# EAGLE design currentBaseBoard_v4 (EAGLE 9.5.1)
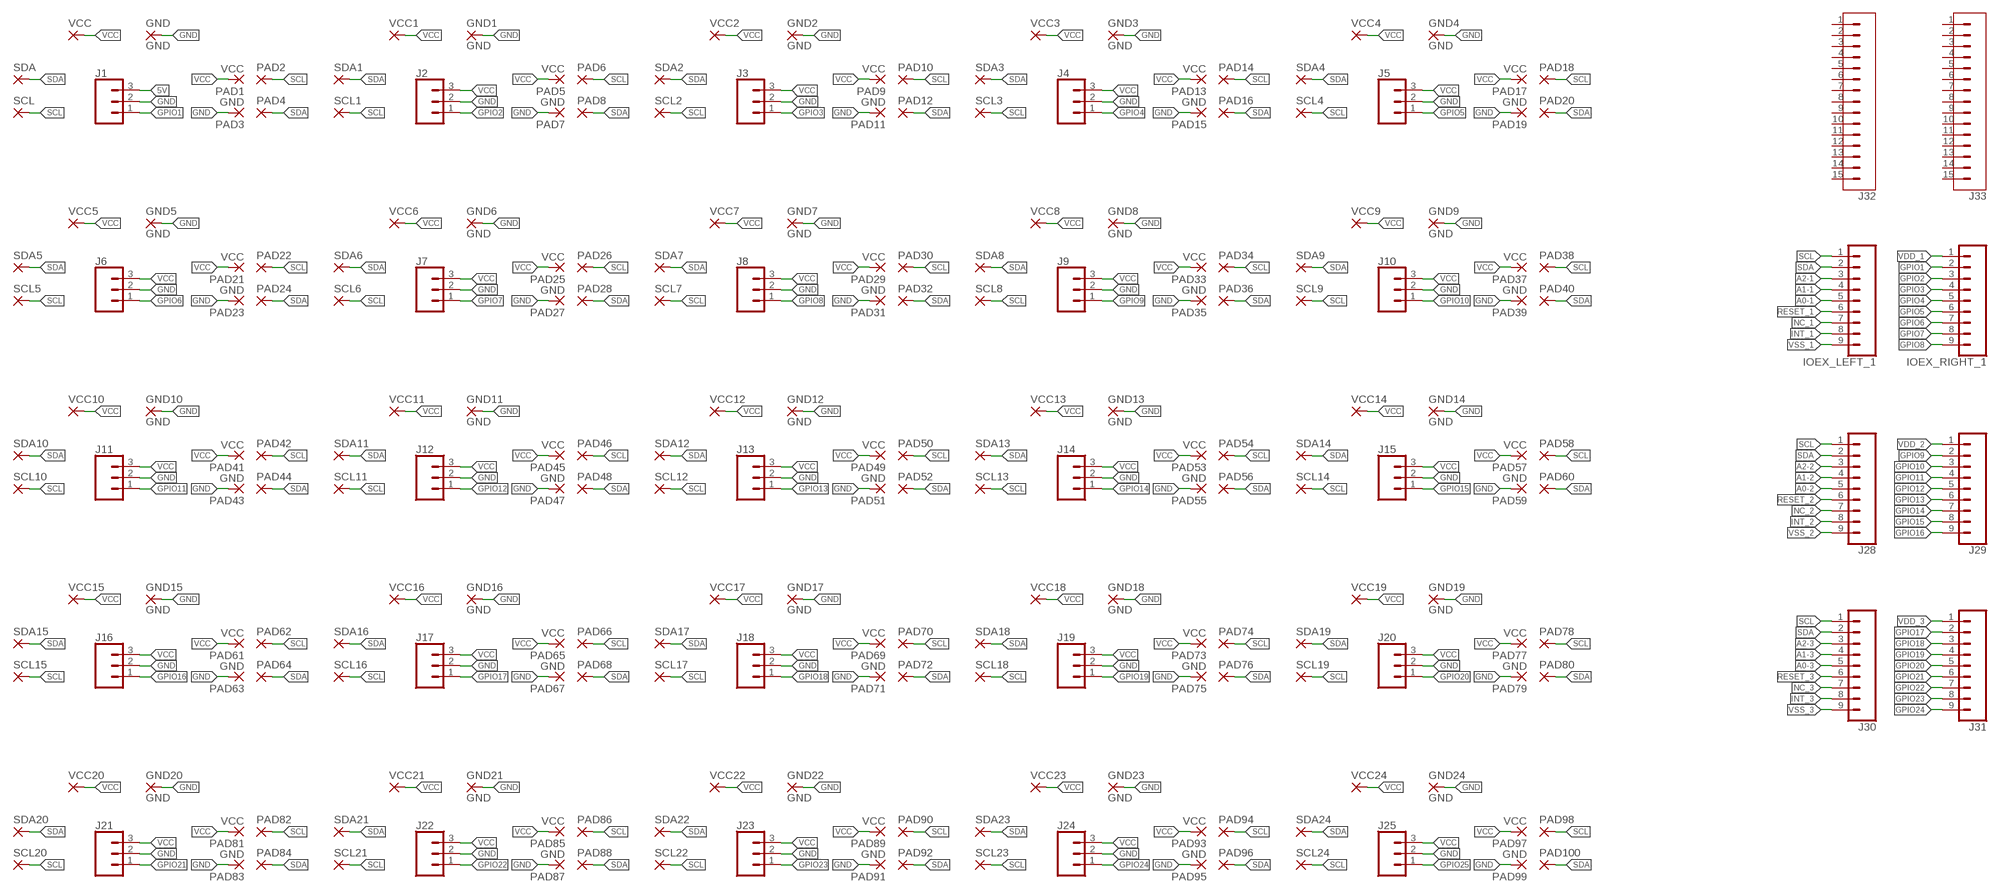
[diagram p0: schematic, sheet 1]

## Parts
GND  GND  2,15/1,0  [2,15/1,0]
GND1  GND  2,15/1,0  [2,15/1,0]
GND2  GND  2,15/1,0  [2,15/1,0]
GND3  GND  2,15/1,0  [2,15/1,0]
GND4  GND  2,15/1,0  [2,15/1,0]
GND5  GND  2,15/1,0  [2,15/1,0]
GND6  GND  2,15/1,0  [2,15/1,0]
GND7  GND  2,15/1,0  [2,15/1,0]
GND8  GND  2,15/1,0  [2,15/1,0]
GND9  GND  2,15/1,0  [2,15/1,0]
GND10  GND  2,15/1,0  [2,15/1,0]
GND11  GND  2,15/1,0  [2,15/1,0]
GND12  GND  2,15/1,0  [2,15/1,0]
GND13  GND  2,15/1,0  [2,15/1,0]
GND14  GND  2,15/1,0  [2,15/1,0]
GND15  GND  2,15/1,0  [2,15/1,0]
GND16  GND  2,15/1,0  [2,15/1,0]
GND17  GND  2,15/1,0  [2,15/1,0]
GND18  GND  2,15/1,0  [2,15/1,0]
GND19  GND  2,15/1,0  [2,15/1,0]
GND20  GND  2,15/1,0  [2,15/1,0]
GND21  GND  2,15/1,0  [2,15/1,0]
GND22  GND  2,15/1,0  [2,15/1,0]
GND23  GND  2,15/1,0  [2,15/1,0]
GND24  GND  2,15/1,0  [2,15/1,0]
IOEX_LEFT_1  CONN_09  [1X09]
IOEX_RIGHT_1  CONN_09  [1X09]
J1  CONN_03  [1X03]
J2  CONN_03  [1X03]
J3  CONN_03  [1X03]
J4  CONN_03  [1X03]
J5  CONN_03  [1X03]
J6  CONN_03  [1X03]
J7  CONN_03  [1X03]
J8  CONN_03  [1X03]
J9  CONN_03  [1X03]
J10  CONN_03  [1X03]
J11  CONN_03  [1X03]
J12  CONN_03  [1X03]
J13  CONN_03  [1X03]
J14  CONN_03  [1X03]
J15  CONN_03  [1X03]
J16  CONN_03  [1X03]
J17  CONN_03  [1X03]
J18  CONN_03  [1X03]
J19  CONN_03  [1X03]
J20  CONN_03  [1X03]
J21  CONN_03  [1X03]
J22  CONN_03  [1X03]
J23  CONN_03  [1X03]
J24  CONN_03  [1X03]
J25  CONN_03  [1X03]
J28  CONN_09  [1X09]
J29  CONN_09  [1X09]
J30  CONN_09  [1X09]
J31  CONN_09  [1X09]
J32  CONN_06SMD_MALE  [1X15_SMD_MALE]
J33  CONN_06SMD_MALE  [1X15_SMD_MALE]
PAD1  VCC  2,15/1,0  [2,15/1,0]
PAD2  2,15/1,0  [2,15/1,0]
PAD3  GND  2,15/1,0  [2,15/1,0]
PAD4  2,15/1,0  [2,15/1,0]
PAD5  VCC  2,15/1,0  [2,15/1,0]
PAD6  2,15/1,0  [2,15/1,0]
PAD7  GND  2,15/1,0  [2,15/1,0]
PAD8  2,15/1,0  [2,15/1,0]
PAD9  VCC  2,15/1,0  [2,15/1,0]
PAD10  2,15/1,0  [2,15/1,0]
PAD11  GND  2,15/1,0  [2,15/1,0]
PAD12  2,15/1,0  [2,15/1,0]
PAD13  VCC  2,15/1,0  [2,15/1,0]
PAD14  2,15/1,0  [2,15/1,0]
PAD15  GND  2,15/1,0  [2,15/1,0]
PAD16  2,15/1,0  [2,15/1,0]
PAD17  VCC  2,15/1,0  [2,15/1,0]
PAD18  2,15/1,0  [2,15/1,0]
PAD19  GND  2,15/1,0  [2,15/1,0]
PAD20  2,15/1,0  [2,15/1,0]
PAD21  VCC  2,15/1,0  [2,15/1,0]
PAD22  2,15/1,0  [2,15/1,0]
PAD23  GND  2,15/1,0  [2,15/1,0]
PAD24  2,15/1,0  [2,15/1,0]
PAD25  VCC  2,15/1,0  [2,15/1,0]
PAD26  2,15/1,0  [2,15/1,0]
PAD27  GND  2,15/1,0  [2,15/1,0]
PAD28  2,15/1,0  [2,15/1,0]
PAD29  VCC  2,15/1,0  [2,15/1,0]
PAD30  2,15/1,0  [2,15/1,0]
PAD31  GND  2,15/1,0  [2,15/1,0]
PAD32  2,15/1,0  [2,15/1,0]
PAD33  VCC  2,15/1,0  [2,15/1,0]
PAD34  2,15/1,0  [2,15/1,0]
PAD35  GND  2,15/1,0  [2,15/1,0]
PAD36  2,15/1,0  [2,15/1,0]
PAD37  VCC  2,15/1,0  [2,15/1,0]
PAD38  2,15/1,0  [2,15/1,0]
PAD39  GND  2,15/1,0  [2,15/1,0]
PAD40  2,15/1,0  [2,15/1,0]
PAD41  VCC  2,15/1,0  [2,15/1,0]
PAD42  2,15/1,0  [2,15/1,0]
PAD43  GND  2,15/1,0  [2,15/1,0]
PAD44  2,15/1,0  [2,15/1,0]
PAD45  VCC  2,15/1,0  [2,15/1,0]
PAD46  2,15/1,0  [2,15/1,0]
PAD47  GND  2,15/1,0  [2,15/1,0]
PAD48  2,15/1,0  [2,15/1,0]
PAD49  VCC  2,15/1,0  [2,15/1,0]
PAD50  2,15/1,0  [2,15/1,0]
PAD51  GND  2,15/1,0  [2,15/1,0]
PAD52  2,15/1,0  [2,15/1,0]
PAD53  VCC  2,15/1,0  [2,15/1,0]
PAD54  2,15/1,0  [2,15/1,0]
PAD55  GND  2,15/1,0  [2,15/1,0]
PAD56  2,15/1,0  [2,15/1,0]
PAD57  VCC  2,15/1,0  [2,15/1,0]
PAD58  2,15/1,0  [2,15/1,0]
PAD59  GND  2,15/1,0  [2,15/1,0]
PAD60  2,15/1,0  [2,15/1,0]
PAD61  VCC  2,15/1,0  [2,15/1,0]
PAD62  2,15/1,0  [2,15/1,0]
PAD63  GND  2,15/1,0  [2,15/1,0]
PAD64  2,15/1,0  [2,15/1,0]
PAD65  VCC  2,15/1,0  [2,15/1,0]
PAD66  2,15/1,0  [2,15/1,0]
PAD67  GND  2,15/1,0  [2,15/1,0]
PAD68  2,15/1,0  [2,15/1,0]
PAD69  VCC  2,15/1,0  [2,15/1,0]
PAD70  2,15/1,0  [2,15/1,0]
PAD71  GND  2,15/1,0  [2,15/1,0]
PAD72  2,15/1,0  [2,15/1,0]
PAD73  VCC  2,15/1,0  [2,15/1,0]
PAD74  2,15/1,0  [2,15/1,0]
PAD75  GND  2,15/1,0  [2,15/1,0]
PAD76  2,15/1,0  [2,15/1,0]
PAD77  VCC  2,15/1,0  [2,15/1,0]
PAD78  2,15/1,0  [2,15/1,0]
PAD79  GND  2,15/1,0  [2,15/1,0]
PAD80  2,15/1,0  [2,15/1,0]
PAD81  VCC  2,15/1,0  [2,15/1,0]
PAD82  2,15/1,0  [2,15/1,0]
PAD83  GND  2,15/1,0  [2,15/1,0]
PAD84  2,15/1,0  [2,15/1,0]
PAD85  VCC  2,15/1,0  [2,15/1,0]
PAD86  2,15/1,0  [2,15/1,0]
PAD87  GND  2,15/1,0  [2,15/1,0]
PAD88  2,15/1,0  [2,15/1,0]
PAD89  VCC  2,15/1,0  [2,15/1,0]
PAD90  2,15/1,0  [2,15/1,0]
PAD91  GND  2,15/1,0  [2,15/1,0]
PAD92  2,15/1,0  [2,15/1,0]
PAD93  VCC  2,15/1,0  [2,15/1,0]
PAD94  2,15/1,0  [2,15/1,0]
PAD95  GND  2,15/1,0  [2,15/1,0]
PAD96  2,15/1,0  [2,15/1,0]
PAD97  VCC  2,15/1,0  [2,15/1,0]
PAD98  2,15/1,0  [2,15/1,0]
PAD99  GND  2,15/1,0  [2,15/1,0]
PAD100  2,15/1,0  [2,15/1,0]
SCL  2,15/1,0  [2,15/1,0]
SCL1  2,15/1,0  [2,15/1,0]
SCL2  2,15/1,0  [2,15/1,0]
SCL3  2,15/1,0  [2,15/1,0]
SCL4  2,15/1,0  [2,15/1,0]
SCL5  2,15/1,0  [2,15/1,0]
SCL6  2,15/1,0  [2,15/1,0]
SCL7  2,15/1,0  [2,15/1,0]
SCL8  2,15/1,0  [2,15/1,0]
SCL9  2,15/1,0  [2,15/1,0]
SCL10  2,15/1,0  [2,15/1,0]
SCL11  2,15/1,0  [2,15/1,0]
SCL12  2,15/1,0  [2,15/1,0]
SCL13  2,15/1,0  [2,15/1,0]
SCL14  2,15/1,0  [2,15/1,0]
SCL15  2,15/1,0  [2,15/1,0]
SCL16  2,15/1,0  [2,15/1,0]
SCL17  2,15/1,0  [2,15/1,0]
SCL18  2,15/1,0  [2,15/1,0]
SCL19  2,15/1,0  [2,15/1,0]
SCL20  2,15/1,0  [2,15/1,0]
SCL21  2,15/1,0  [2,15/1,0]
SCL22  2,15/1,0  [2,15/1,0]
SCL23  2,15/1,0  [2,15/1,0]
SCL24  2,15/1,0  [2,15/1,0]
SDA  2,15/1,0  [2,15/1,0]
SDA1  2,15/1,0  [2,15/1,0]
SDA2  2,15/1,0  [2,15/1,0]
SDA3  2,15/1,0  [2,15/1,0]
SDA4  2,15/1,0  [2,15/1,0]
SDA5  2,15/1,0  [2,15/1,0]
SDA6  2,15/1,0  [2,15/1,0]
SDA7  2,15/1,0  [2,15/1,0]
SDA8  2,15/1,0  [2,15/1,0]
SDA9  2,15/1,0  [2,15/1,0]
SDA10  2,15/1,0  [2,15/1,0]
SDA11  2,15/1,0  [2,15/1,0]
SDA12  2,15/1,0  [2,15/1,0]
SDA13  2,15/1,0  [2,15/1,0]
SDA14  2,15/1,0  [2,15/1,0]
SDA15  2,15/1,0  [2,15/1,0]
SDA16  2,15/1,0  [2,15/1,0]
SDA17  2,15/1,0  [2,15/1,0]
SDA18  2,15/1,0  [2,15/1,0]
SDA19  2,15/1,0  [2,15/1,0]
SDA20  2,15/1,0  [2,15/1,0]
SDA21  2,15/1,0  [2,15/1,0]
SDA22  2,15/1,0  [2,15/1,0]
SDA23  2,15/1,0  [2,15/1,0]
SDA24  2,15/1,0  [2,15/1,0]
VCC  2,15/1,0  [2,15/1,0]
VCC1  2,15/1,0  [2,15/1,0]
VCC2  2,15/1,0  [2,15/1,0]
VCC3  2,15/1,0  [2,15/1,0]
VCC4  2,15/1,0  [2,15/1,0]
VCC5  2,15/1,0  [2,15/1,0]
VCC6  2,15/1,0  [2,15/1,0]
VCC7  2,15/1,0  [2,15/1,0]
VCC8  2,15/1,0  [2,15/1,0]
VCC9  2,15/1,0  [2,15/1,0]
VCC10  2,15/1,0  [2,15/1,0]
VCC11  2,15/1,0  [2,15/1,0]
VCC12  2,15/1,0  [2,15/1,0]
VCC13  2,15/1,0  [2,15/1,0]
VCC14  2,15/1,0  [2,15/1,0]
VCC15  2,15/1,0  [2,15/1,0]
VCC16  2,15/1,0  [2,15/1,0]
VCC17  2,15/1,0  [2,15/1,0]
VCC18  2,15/1,0  [2,15/1,0]
VCC19  2,15/1,0  [2,15/1,0]
VCC20  2,15/1,0  [2,15/1,0]
VCC21  2,15/1,0  [2,15/1,0]
VCC22  2,15/1,0  [2,15/1,0]
VCC23  2,15/1,0  [2,15/1,0]
VCC24  2,15/1,0  [2,15/1,0]

## Nets
5V: J1.3
A0-1: IOEX_LEFT_1.5
A0-2: J28.5
A0-3: J30.5
A1-1: IOEX_LEFT_1.4
A1-2: J28.4
A1-3: J30.4
A2-1: IOEX_LEFT_1.3
A2-2: J28.3
A2-3: J30.3
GND: GND1.1(P) GND2.1(P) GND3.1(P) GND4.1(P) GND5.1(P) GND6.1(P) GND7.1(P) GND8.1(P) GND9.1(P) GND10.1(P) GND11.1(P) GND12.1(P) GND13.1(P) GND14.1(P) GND15.1(P) GND16.1(P) GND17.1(P) GND18.1(P) GND19.1(P) GND20.1(P) GND21.1(P) GND22.1(P) GND23.1(P) GND24.1(P) GND.1(P) J1.2 J2.2 J3.2 J4.2 J5.2 J6.2 J7.2 J8.2 J9.2 J10.2 J11.2 J12.2 J13.2 J14.2 J15.2 J16.2 J17.2 J18.2 J19.2 J20.2 J21.2 J22.2 J23.2 J24.2 J25.2 PAD3.1(P) PAD7.1(P) PAD11.1(P) PAD15.1(P) PAD19.1(P) PAD23.1(P) PAD27.1(P) PAD31.1(P) PAD35.1(P) PAD39.1(P) PAD43.1(P) PAD47.1(P) PAD51.1(P) PAD55.1(P) PAD59.1(P) PAD63.1(P) PAD67.1(P) PAD71.1(P) PAD75.1(P) PAD79.1(P) PAD83.1(P) PAD87.1(P) PAD91.1(P) PAD95.1(P) PAD99.1(P)
GPIO1: IOEX_RIGHT_1.2 J1.1
GPIO2: IOEX_RIGHT_1.3 J2.1
GPIO3: IOEX_RIGHT_1.4 J3.1
GPIO4: IOEX_RIGHT_1.5 J4.1
GPIO5: IOEX_RIGHT_1.6 J5.1
GPIO6: IOEX_RIGHT_1.7 J6.1
GPIO7: IOEX_RIGHT_1.8 J7.1
GPIO8: IOEX_RIGHT_1.9 J8.1
GPIO9: J9.1 J29.2
GPIO10: J10.1 J29.3
GPIO11: J11.1 J29.4
GPIO12: J12.1 J29.5
GPIO13: J13.1 J29.6
GPIO14: J14.1 J29.7
GPIO15: J15.1 J29.8
GPIO16: J16.1 J29.9
GPIO17: J17.1 J31.2
GPIO18: J18.1 J31.3
GPIO19: J19.1 J31.4
GPIO20: J20.1 J31.5
GPIO21: J21.1 J31.6
GPIO22: J22.1 J31.7
GPIO23: J23.1 J31.8
GPIO24: J24.1 J31.9
GPIO25: J25.1
INT_1: IOEX_LEFT_1.8
INT_2: J28.8
INT_3: J30.8
NC_1: IOEX_LEFT_1.7
NC_2: J28.7
NC_3: J30.7
RESET_1: IOEX_LEFT_1.6
RESET_2: J28.6
RESET_3: J30.6
SCL: IOEX_LEFT_1.1 J28.1 J30.1 PAD2.1(P) PAD6.1(P) PAD10.1(P) PAD14.1(P) PAD18.1(P) PAD22.1(P) PAD26.1(P) PAD30.1(P) PAD34.1(P) PAD38.1(P) PAD42.1(P) PAD46.1(P) PAD50.1(P) PAD54.1(P) PAD58.1(P) PAD62.1(P) PAD66.1(P) PAD70.1(P) PAD74.1(P) PAD78.1(P) PAD82.1(P) PAD86.1(P) PAD90.1(P) PAD94.1(P) PAD98.1(P) SCL1.1(P) SCL2.1(P) SCL3.1(P) SCL4.1(P) SCL5.1(P) SCL6.1(P) SCL7.1(P) SCL8.1(P) SCL9.1(P) SCL10.1(P) SCL11.1(P) SCL12.1(P) SCL13.1(P) SCL14.1(P) SCL15.1(P) SCL16.1(P) SCL17.1(P) SCL18.1(P) SCL19.1(P) SCL20.1(P) SCL21.1(P) SCL22.1(P) SCL23.1(P) SCL24.1(P) SCL.1(P)
SDA: IOEX_LEFT_1.2 J28.2 J30.2 PAD4.1(P) PAD8.1(P) PAD12.1(P) PAD16.1(P) PAD20.1(P) PAD24.1(P) PAD28.1(P) PAD32.1(P) PAD36.1(P) PAD40.1(P) PAD44.1(P) PAD48.1(P) PAD52.1(P) PAD56.1(P) PAD60.1(P) PAD64.1(P) PAD68.1(P) PAD72.1(P) PAD76.1(P) PAD80.1(P) PAD84.1(P) PAD88.1(P) PAD92.1(P) PAD96.1(P) PAD100.1(P) SDA1.1(P) SDA2.1(P) SDA3.1(P) SDA4.1(P) SDA5.1(P) SDA6.1(P) SDA7.1(P) SDA8.1(P) SDA9.1(P) SDA10.1(P) SDA11.1(P) SDA12.1(P) SDA13.1(P) SDA14.1(P) SDA15.1(P) SDA16.1(P) SDA17.1(P) SDA18.1(P) SDA19.1(P) SDA20.1(P) SDA21.1(P) SDA22.1(P) SDA23.1(P) SDA24.1(P) SDA.1(P)
VCC: J2.3 J3.3 J4.3 J5.3 J6.3 J7.3 J8.3 J9.3 J10.3 J11.3 J12.3 J13.3 J14.3 J15.3 J16.3 J17.3 J18.3 J19.3 J20.3 J21.3 J22.3 J23.3 J24.3 J25.3 PAD1.1(P) PAD5.1(P) PAD9.1(P) PAD13.1(P) PAD17.1(P) PAD21.1(P) PAD25.1(P) PAD29.1(P) PAD33.1(P) PAD37.1(P) PAD41.1(P) PAD45.1(P) PAD49.1(P) PAD53.1(P) PAD57.1(P) PAD61.1(P) PAD65.1(P) PAD69.1(P) PAD73.1(P) PAD77.1(P) PAD81.1(P) PAD85.1(P) PAD89.1(P) PAD93.1(P) PAD97.1(P) VCC1.1(P) VCC2.1(P) VCC3.1(P) VCC4.1(P) VCC5.1(P) VCC6.1(P) VCC7.1(P) VCC8.1(P) VCC9.1(P) VCC10.1(P) VCC11.1(P) VCC12.1(P) VCC13.1(P) VCC14.1(P) VCC15.1(P) VCC16.1(P) VCC17.1(P) VCC18.1(P) VCC19.1(P) VCC20.1(P) VCC21.1(P) VCC22.1(P) VCC23.1(P) VCC24.1(P) VCC.1(P)
VDD_1: IOEX_RIGHT_1.1
VDD_2: J29.1
VDD_3: J31.1
VSS_1: IOEX_LEFT_1.9
VSS_2: J28.9
VSS_3: J30.9
Unconnected: J32.1 J32.2 J32.3 J32.4 J32.5 J32.6 J32.7 J32.8 J32.9 J32.10 J32.11 J32.12 J32.13 J32.14 J32.15 J33.1 J33.2 J33.3 J33.4 J33.5 J33.6 J33.7 J33.8 J33.9 J33.10 J33.11 J33.12 J33.13 J33.14 J33.15

## Library data of the parts
GND GND1-GND24 PAD1-PAD100 SCL SCL1-SCL24 SDA SDA1-SDA24 VCC VCC1-VCC24 = wirepad:2,15/1,0: THROUGH-HOLE PAD
IOEX_LEFT_1 IOEX_RIGHT_1 J28-J31 = SparkFun-Connectors:CONN_09: Multi connection point. Often used as Generic Header-pin footprint for 0.1 inch spaced/style header connections On any of the 0.1 inch spaced packages, you can populate with these: Break Away Headers - Straight <https://www.sparkfun.com/products/116> (PRT-00116) Break Away Male Headers - Right Angle <https://www.sparkfun.com/products/553> (PRT-00553) Female Headers <https://www.sparkfun.com/products/115> (PRT-00115) Break Away Headers - Machine Pin <https://www.sparkfun.com/products/117> (PRT-00117) Break Away Female Headers - Swiss Machine Pin <https://www.sparkfun.com/products/743> (PRT-00743) For SCREWTERMINALS and SPRING TERMINALS visit here: Screw Terimnals on SparkFun.com <https://www.sparkfun.com/search/results?term=Screw+Terminals> (5mm/3.5mm/2.54mm spacing) This device is also useful as a general connection point to wire up your design to another part of your project. Our various solder wires solder well into these plated through hole pads. Hook-Up Wire - Assortment (Stranded, 22 AWG) <https://www.sparkfun.com/products/11375> (PRT-11375) Hook-Up Wire - Assortment (Solid Core, 22 AWG) <https://www.sparkfun.com/products/11367> (PRT-11367) View the entire wire category on our website here <https://www.sparkfun.com/categories/141> Special notes: Molex polarized connector foot print use with SKU : PRT-08231 with associated crimp pins and housings. 1MM SMD Version SKU: PRT-10208 NOTES ON THE VARIANTS LOCK and LOCK_LONGPADS... This footprint was designed to help hold the alignment of a through-hole component (i.e. 6-pin header) while soldering it into place. You may notice that each hole has been shifted either up or down by 0.005 of an inch from it's more standard position (which is a perfectly straight line). This slight alteration caused the pins (the squares in the middle) to touch the edges of the holes. Because they are alternating, it causes a "brace" to hold the component in place. 0.005 has proven to be the perfect amount of "off-center" position when using our standard breakaway headers. Although looks a little odd when you look at the bare footprint, once you have a header in there, the alteration is very hard to notice. Also,if you push a header all the way into place, it is covered up entirely on the bottom side.
J1-J25 = SparkFun-Connectors:CONN_03: Multi connection point. Often used as Generic Header-pin footprint for 0.1 inch spaced/style header connections On any of the 0.1 inch spaced packages, you can populate with these: Break Away Headers - Straight <https://www.sparkfun.com/products/116> (PRT-00116) Break Away Male Headers - Right Angle <https://www.sparkfun.com/products/553> (PRT-00553) Female Headers <https://www.sparkfun.com/products/115> (PRT-00115) Break Away Headers - Machine Pin <https://www.sparkfun.com/products/117> (PRT-00117) Break Away Female Headers - Swiss Machine Pin <https://www.sparkfun.com/products/743> (PRT-00743) Stackable Header - 3 Pin (Female, 0.1") <https://www.sparkfun.com/products/13875> (PRT-13875) For SCREWTERMINALS and SPRING TERMINALS visit here: Screw Terimnals on SparkFun.com <https://www.sparkfun.com/search/results?term=Screw+Terminals> (5mm/3.5mm/2.54mm spacing) This device is also useful as a general connection point to wire up your design to another part of your project. Our various solder wires solder well into these plated through hole pads. Hook-Up Wire - Assortment (Stranded, 22 AWG) <https://www.sparkfun.com/products/11375> (PRT-11375) Hook-Up Wire - Assortment (Solid Core, 22 AWG) <https://www.sparkfun.com/products/11367> (PRT-11367) View the entire wire category on our website here <https://www.sparkfun.com/categories/141> Special notes: Molex polarized connector foot print use with SKU : PRT-08232 with associated crimp pins and housings.
J32 J33 = capstone footprints:CONN_06: Multi connection point. Often used as Generic Header-pin footprint for 0.1 inch spaced/style header connections On any of the 0.1 inch spaced packages, you can populate with these: Break Away Headers - Straight <https://www.sparkfun.com/products/116> (PRT-00116) Break Away Male Headers - Right Angle <https://www.sparkfun.com/products/553> (PRT-00553) Female Headers <https://www.sparkfun.com/products/115> (PRT-00115) Break Away Headers - Machine Pin <https://www.sparkfun.com/products/117> (PRT-00117) Break Away Female Headers - Swiss Machine Pin <https://www.sparkfun.com/products/743> (PRT-00743) Arduino Stackable Header - 6 Pin <https://www.sparkfun.com/products/9280> (PRT-09280) For SCREWTERMINALS and SPRING TERMINALS visit here: Screw Terimnals on SparkFun.com <https://www.sparkfun.com/search/results?term=Screw+Terminals> (5mm/3.5mm/2.54mm spacing) This device is also useful as a general connection point to wire up your design to another part of your project. Our various solder wires solder well into these plated through hole pads. Hook-Up Wire - Assortment (Stranded, 22 AWG) <https://www.sparkfun.com/products/11375> (PRT-11375) Hook-Up Wire - Assortment (Solid Core, 22 AWG) <https://www.sparkfun.com/products/11367> (PRT-11367) View the entire wire category on our website here <https://www.sparkfun.com/categories/141>; PROD_ID: CONN-11293

## Board
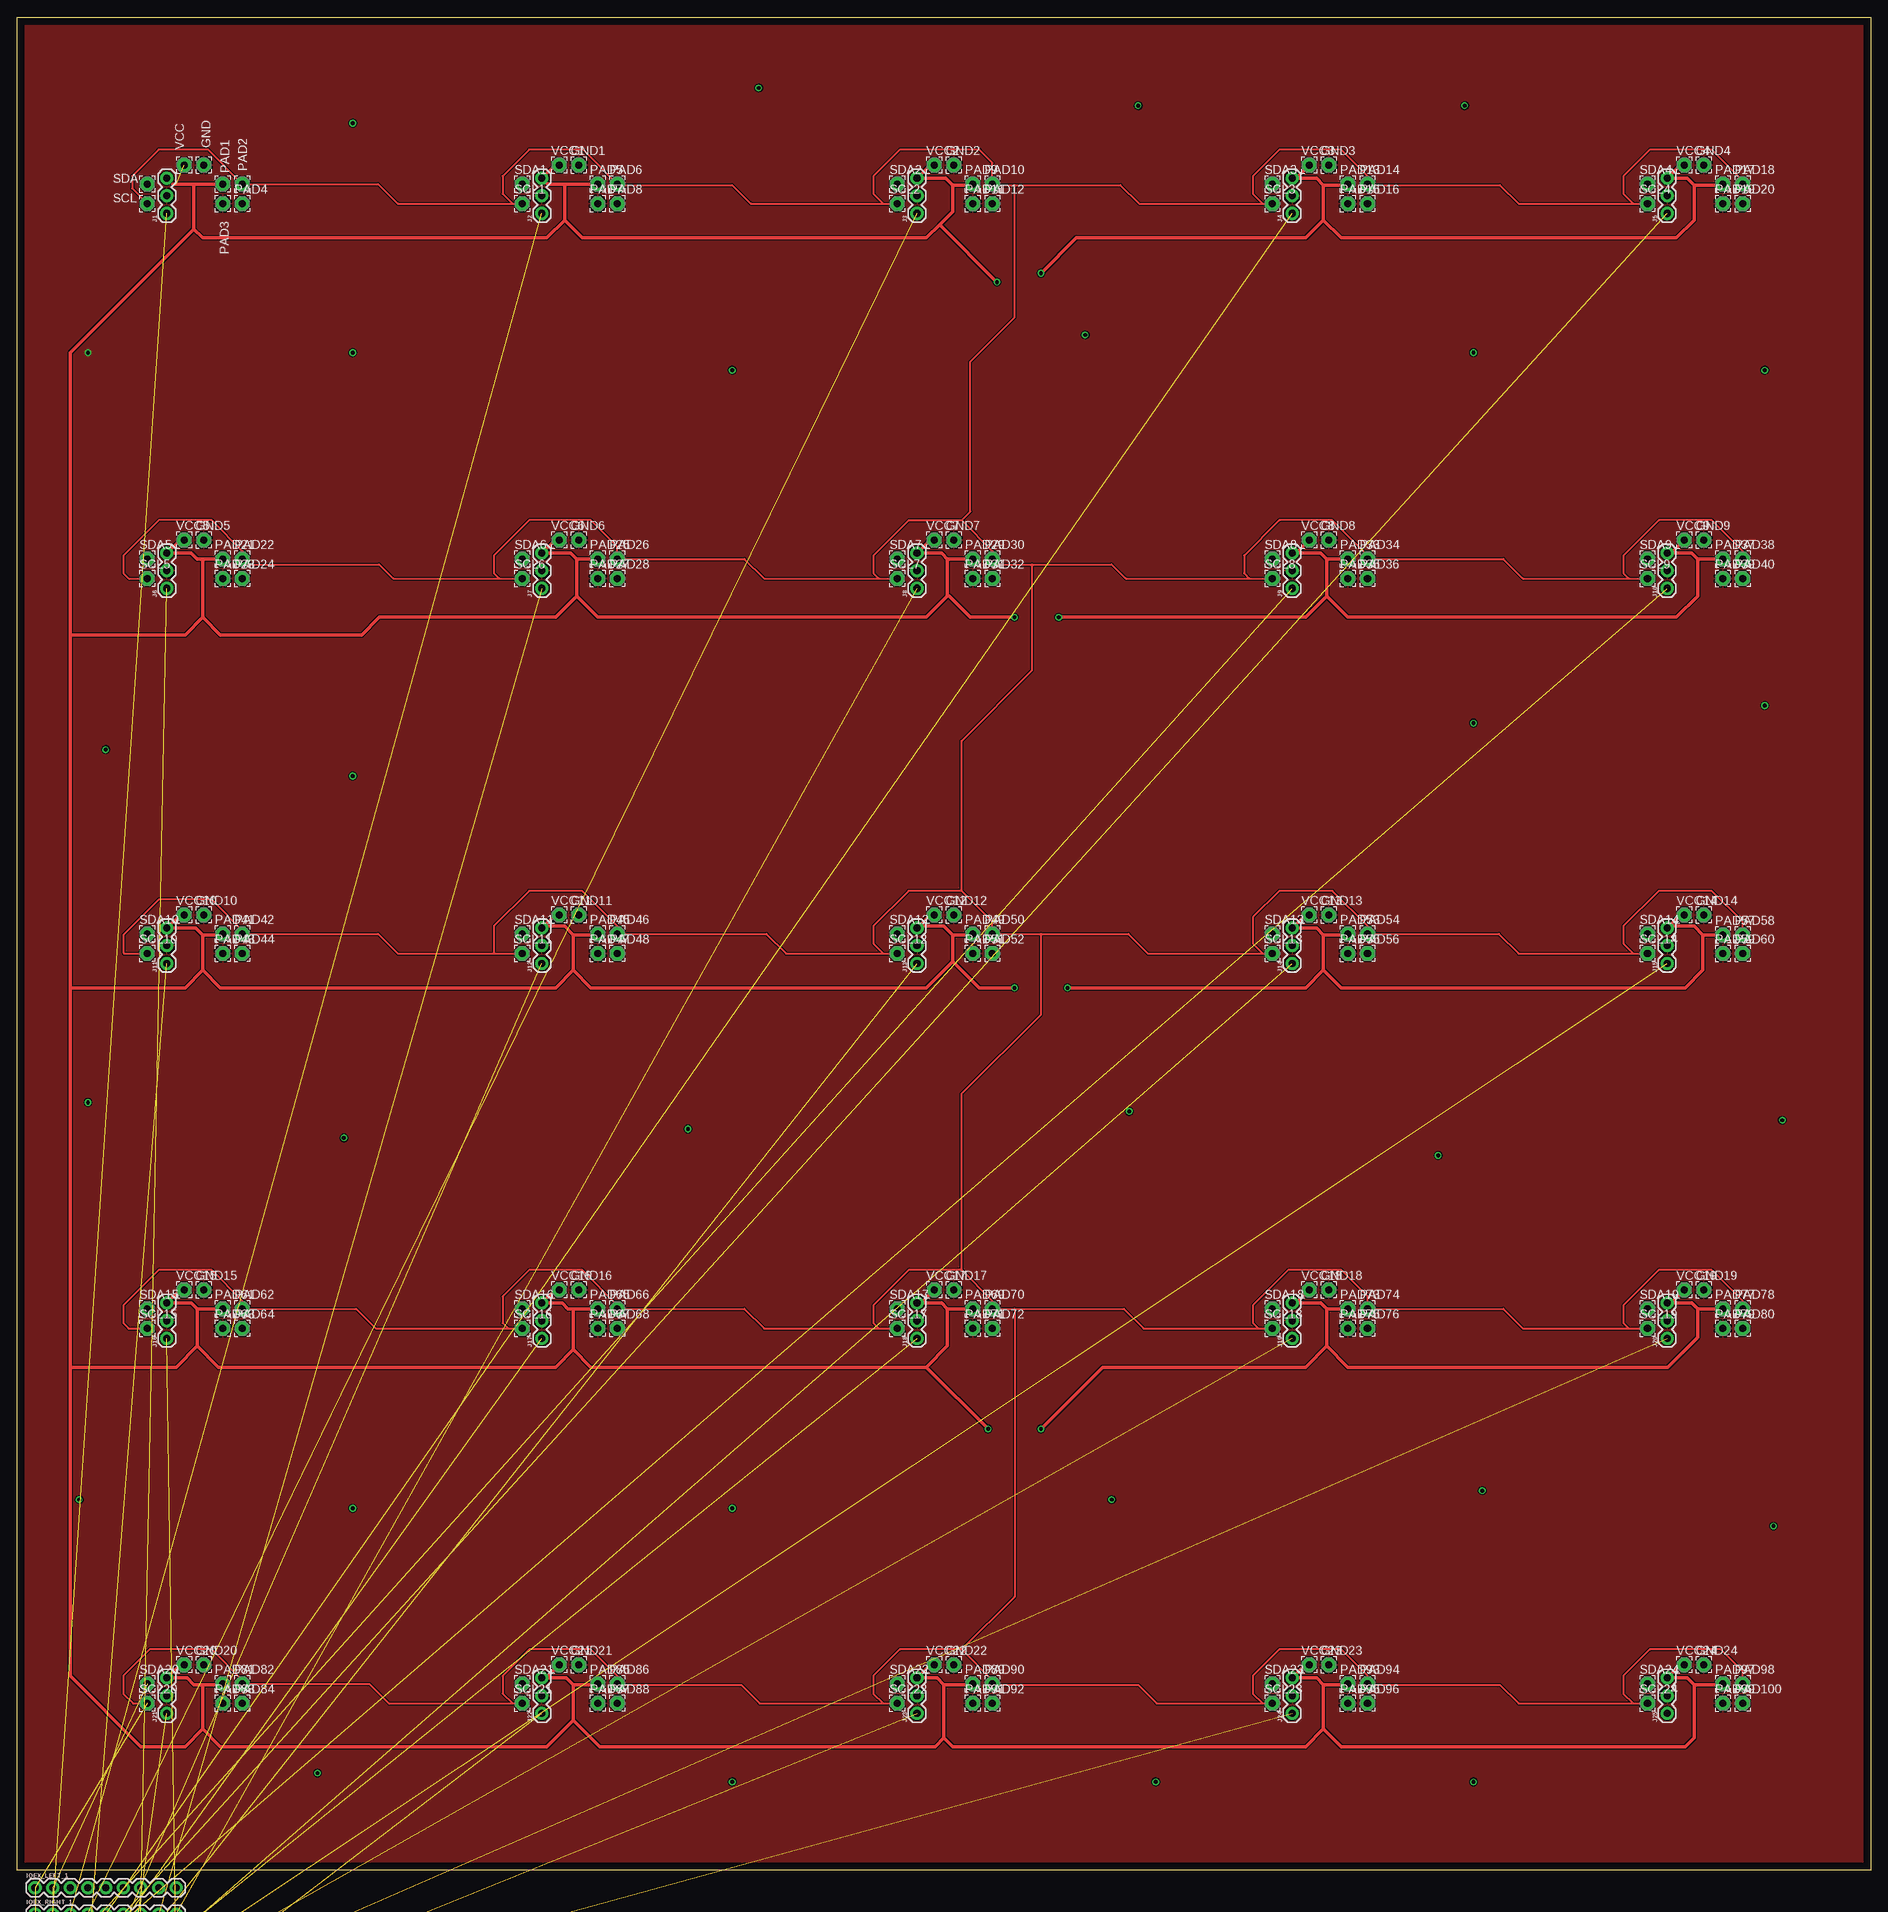
[diagram p1: board, top side]
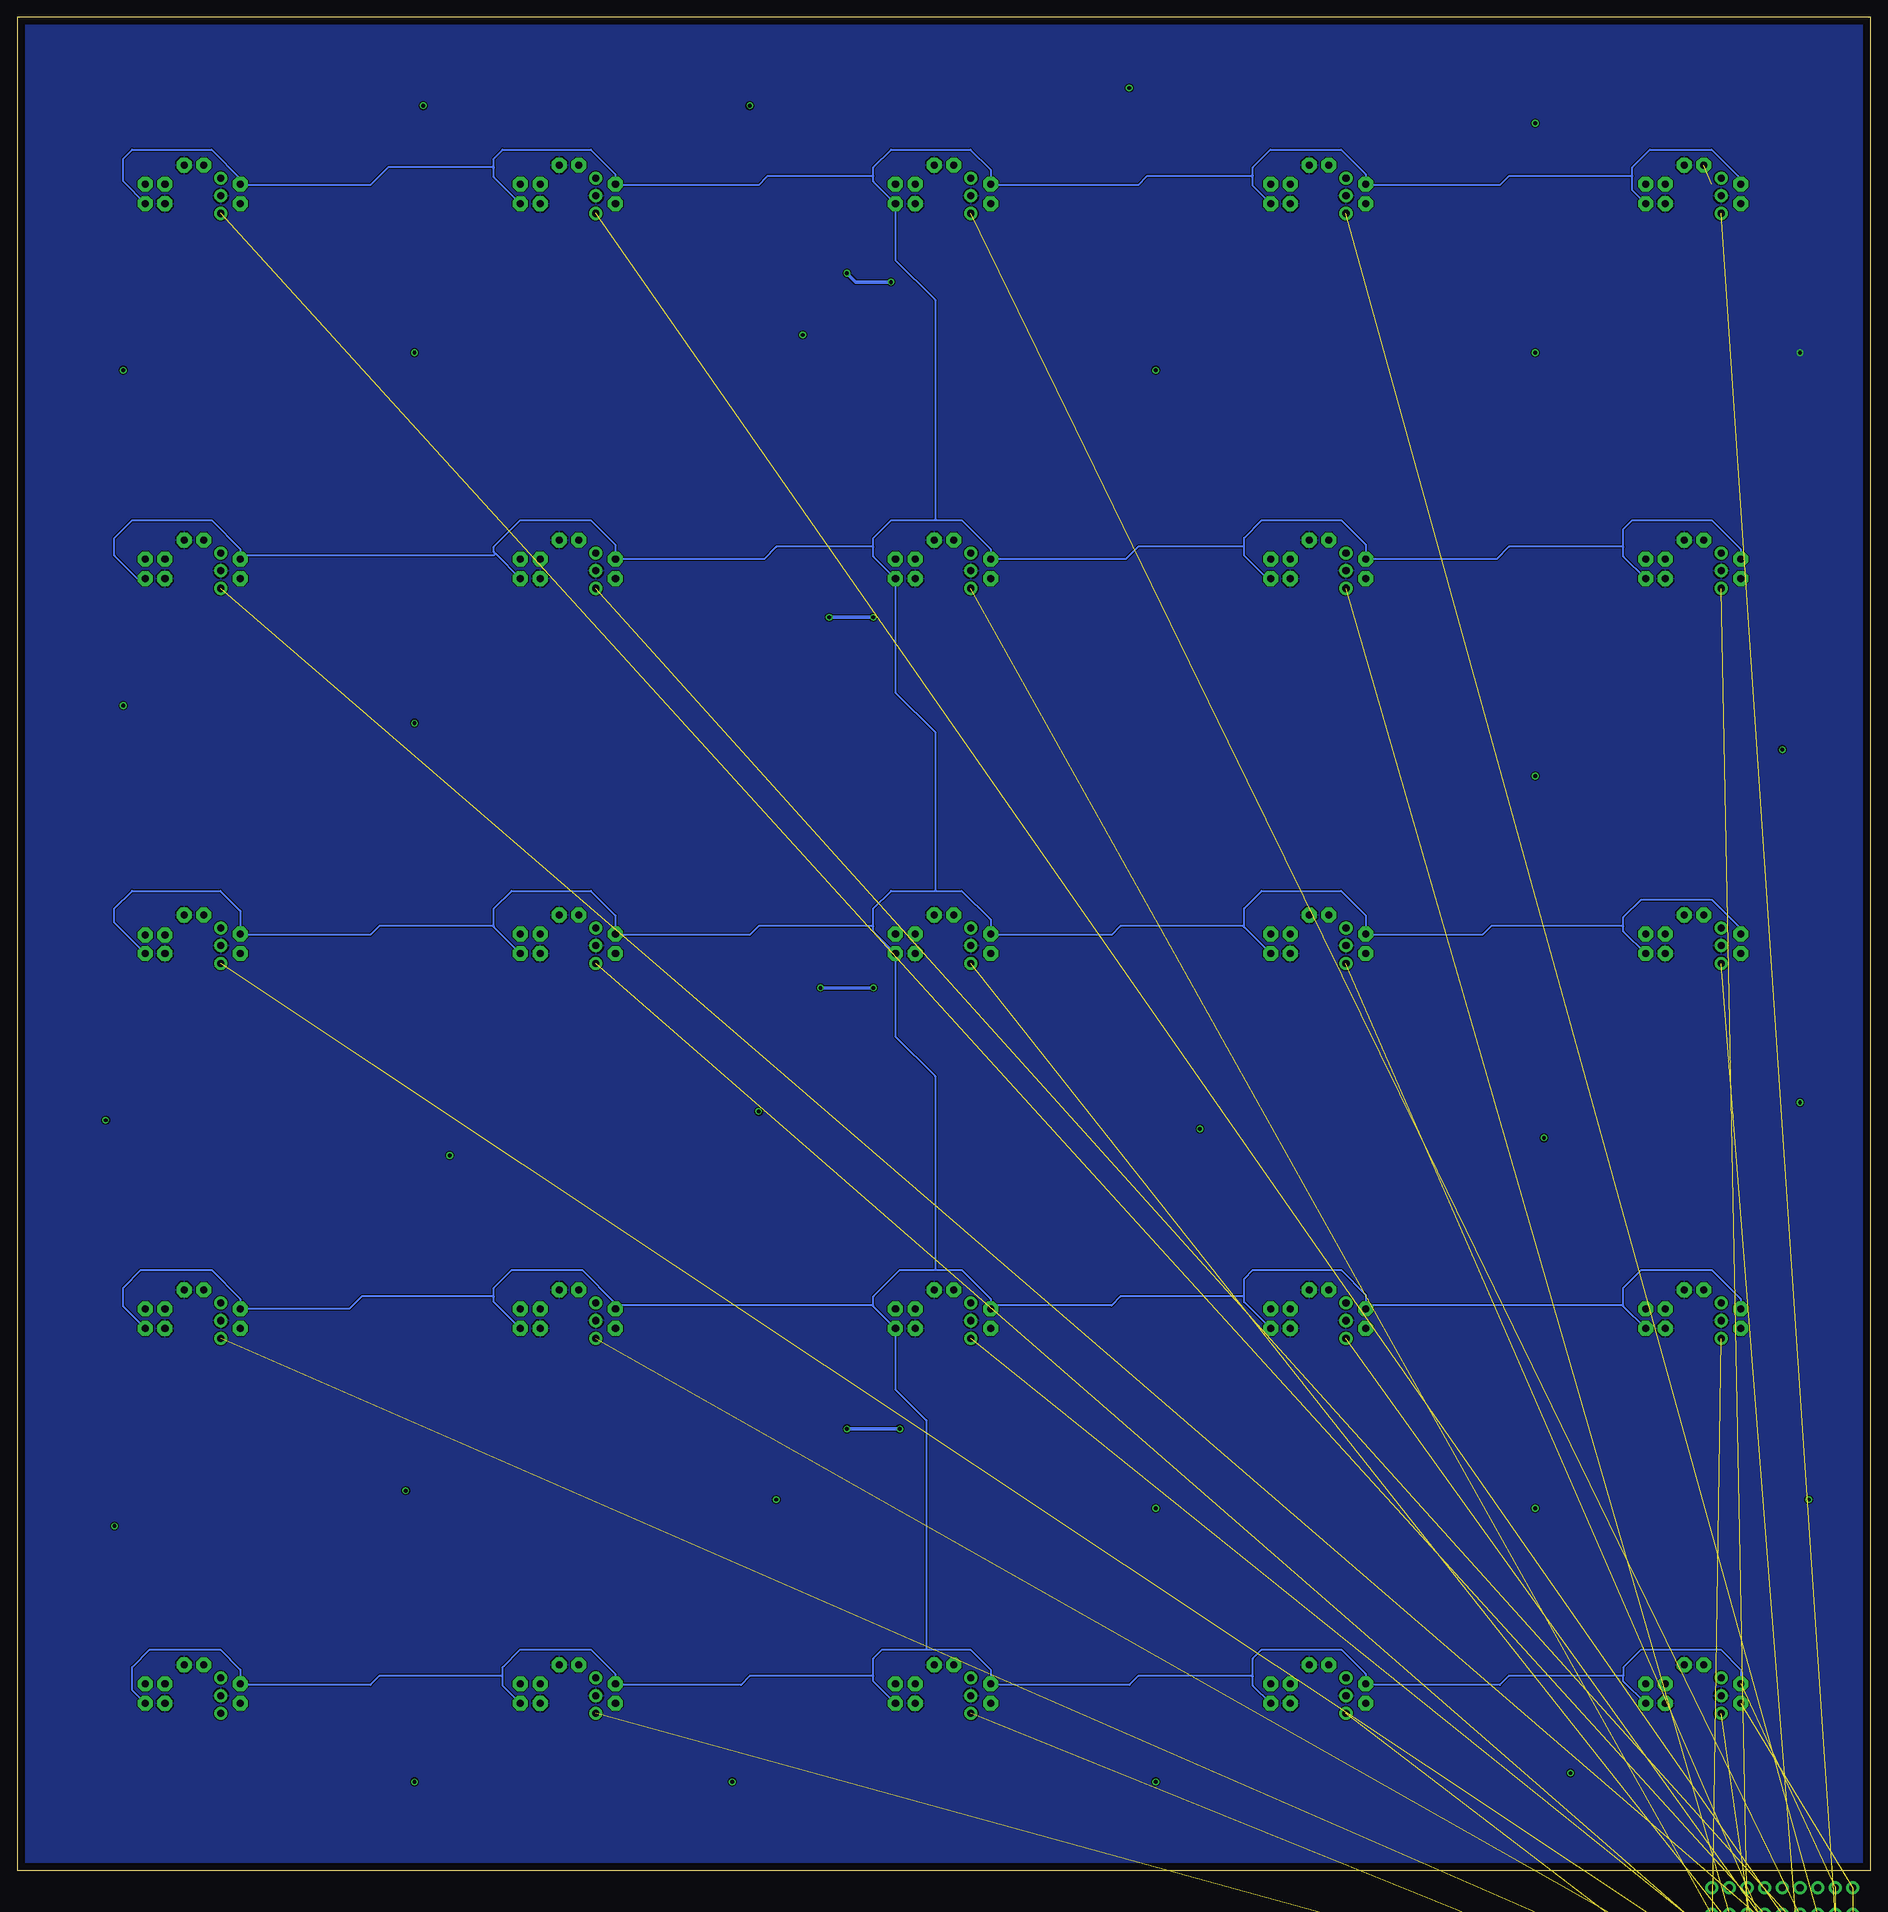
[diagram p2: board, bottom side, seen from below]

Size 266.7 x 266.7 mm. Coordinates in mm from the lower left corner, seen from the top.
Outline: 0,0 0,266.7 266.7,266.7 266.7,0 0,0
Copper layers (1*16): Top 0.035mm / dielectric 1.5mm / Bottom 0.035mm
Design rules "default": minimum track width 6mil, minimum drill 0.35mm, track to track 6mil, track to pad 6mil, pad to pad 6mil, via to via 6mil, smd to smd 6mil, copper to edge 40mil, drill to drill 6mil, minimum pad ring 10mil, minimum via ring 8mil, stop-mask expansion 4mil, vias tented up to drill 0mil, thermal gap 10mil

### Footprints (pad centres in the part's own frame; a part is rotated, then mirrored left to right if it is on the bottom)
2,15/1,0 = drill 1.016 pad 2.159 octagon: 1 0,0
1X09 = drill 1.016 pad 1.88: 1 0,0; 2 2.54,0; 3 5.08,0; 4 7.62,0; 5 10.16,0; 6 12.7,0; 7 15.24,0; 8 17.78,0; 9 20.32,0
1X03 = drill 1.016 pad 1.88: 1 0,0; 2 2.54,0; 3 5.08,0
1X15_SMD_MALE = smd 1.02 x 6: 1 0,0; 2 2.54,0; 3 5.08,0; 4 7.62,0; 5 10.16,0; 6 12.7,0; 7 15.24,0; 8 17.78,0; 9 20.32,0; 10 22.86,0; 11 25.4,0; 12 27.94,0; 13 30.48,0; 14 33.02,0; 15 35.56,0

### Placement (x,y rotation side)
GND  26.81,245.45 0 top
GND1  80.79,245.45 0 top
GND2  134.76,245.45 0 top
GND3  188.74,245.45 0 top
GND4  242.71,245.45 0 top
GND5  26.81,191.47 0 top
GND6  80.79,191.47 0 top
GND7  134.76,191.47 0 top
GND8  188.74,191.47 0 top
GND9  242.71,191.47 0 top
GND10  26.81,137.5 0 top
GND11  80.79,137.5 0 top
GND12  134.76,137.5 0 top
GND13  188.74,137.5 0 top
GND14  242.71,137.5 0 top
GND15  26.81,83.52 0 top
GND16  80.79,83.52 0 top
GND17  134.76,83.52 0 top
GND18  188.74,83.52 0 top
GND19  242.71,83.52 0 top
GND20  26.81,29.55 0 top
GND21  80.79,29.55 0 top
GND22  134.76,29.55 0 top
GND23  188.74,29.55 0 top
GND24  242.71,29.55 0 top
IOEX_LEFT_1  2.54,-2.54 0 top
IOEX_RIGHT_1  2.54,-6.35 0 top  (outside the outline)
J1  21.52,238.48 90 top
J2  75.49,238.48 90 top
J3  129.47,238.48 90 top
J4  183.44,238.48 90 top
J5  237.42,238.48 90 top
J6  21.52,184.5 90 top
J7  75.49,184.5 90 top
J8  129.47,184.5 90 top
J9  183.44,184.5 90 top
J10  237.42,184.5 90 top
J11  21.52,130.53 90 top
J12  75.49,130.53 90 top
J13  129.47,130.53 90 top
J14  183.44,130.53 90 top
J15  237.42,130.53 90 top
J16  21.52,76.55 90 top
J17  75.49,76.55 90 top
J18  129.47,76.55 90 top
J19  183.44,76.55 90 top
J20  237.42,76.55 90 top
J21  21.52,22.58 90 top
J22  75.49,22.58 90 top
J23  129.47,22.58 90 top
J24  183.44,22.58 90 top
J25  237.42,22.58 90 top
J28  2.54,-10.16 0 top  (outside the outline)
J29  2.54,-13.97 0 top  (outside the outline)
J30  2.54,-17.78 0 top  (outside the outline)
J31  2.54,-21.59 0 top  (outside the outline)
J32  2.54,-27.94 0 top  (outside the outline)
J33  2.54,-35.56 0 top  (outside the outline)
PAD1  29.56,242.71 0 top
PAD2  32.38,242.71 0 top
PAD3  29.56,239.89 0 top
PAD4  32.38,239.89 0 top
PAD5  83.53,242.71 0 top
PAD6  86.35,242.71 0 top
PAD7  83.53,239.89 0 top
PAD8  86.35,239.89 0 top
PAD9  137.51,242.71 0 top
PAD10  140.33,242.71 0 top
PAD11  137.51,239.89 0 top
PAD12  140.33,239.89 0 top
PAD13  191.48,242.71 0 top
PAD14  194.3,242.71 0 top
PAD15  191.48,239.89 0 top
PAD16  194.3,239.89 0 top
PAD17  245.46,242.71 0 top
PAD18  248.28,242.71 0 top
PAD19  245.46,239.9 0 top
PAD20  248.28,239.9 0 top
PAD21  29.56,188.74 0 top
PAD22  32.38,188.74 0 top
PAD23  29.56,185.91 0 top
PAD24  32.38,185.91 0 top
PAD25  83.53,188.74 0 top
PAD26  86.35,188.74 0 top
PAD27  83.53,185.91 0 top
PAD28  86.35,185.91 0 top
PAD29  137.51,188.74 0 top
PAD30  140.33,188.74 0 top
PAD31  137.51,185.91 0 top
PAD32  140.33,185.91 0 top
PAD33  191.48,188.74 0 top
PAD34  194.3,188.74 0 top
PAD35  191.48,185.91 0 top
PAD36  194.3,185.91 0 top
PAD37  245.46,188.74 0 top
PAD38  248.28,188.74 0 top
PAD39  245.46,185.91 0 top
PAD40  248.28,185.91 0 top
PAD41  29.56,134.76 0 top
PAD42  32.38,134.76 0 top
PAD43  29.56,131.93 0 top
PAD44  32.38,131.94 0 top
PAD45  83.53,134.76 0 top
PAD46  86.35,134.76 0 top
PAD47  83.53,131.94 0 top
PAD48  86.35,131.94 0 top
PAD49  137.51,134.76 0 top
PAD50  140.33,134.76 0 top
PAD51  137.51,131.94 0 top
PAD52  140.33,131.94 0 top
PAD53  191.48,134.76 0 top
PAD54  194.3,134.76 0 top
PAD55  191.48,131.94 0 top
PAD56  194.3,131.94 0 top
PAD57  245.46,134.62 0 top
PAD58  248.28,134.62 0 top
PAD59  245.46,131.94 0 top
PAD60  248.28,131.94 0 top
PAD61  29.56,80.79 0 top
PAD62  32.38,80.79 0 top
PAD63  29.56,77.96 0 top
PAD64  32.38,77.96 0 top
PAD65  83.53,80.79 0 top
PAD66  86.35,80.79 0 top
PAD67  83.53,77.96 0 top
PAD68  86.35,77.96 0 top
PAD69  137.51,80.79 0 top
PAD70  140.33,80.79 0 top
PAD71  137.51,77.96 0 top
PAD72  140.33,77.96 0 top
PAD73  191.48,80.79 0 top
PAD74  194.3,80.79 0 top
PAD75  191.48,77.96 0 top
PAD76  194.3,77.96 0 top
PAD77  245.46,80.79 0 top
PAD78  248.28,80.79 0 top
PAD79  245.46,77.96 0 top
PAD80  248.28,77.96 0 top
PAD81  29.56,26.81 0 top
PAD82  32.38,26.81 0 top
PAD83  29.56,23.99 0 top
PAD84  32.38,23.99 0 top
PAD85  83.53,26.81 0 top
PAD86  86.35,26.81 0 top
PAD87  83.53,23.99 0 top
PAD88  86.35,23.99 0 top
PAD89  137.51,26.81 0 top
PAD90  140.33,26.81 0 top
PAD91  137.51,23.99 0 top
PAD92  140.33,23.99 0 top
PAD93  191.48,26.81 0 top
PAD94  194.3,26.81 0 top
PAD95  191.48,23.99 0 top
PAD96  194.3,23.99 0 top
PAD97  245.46,26.81 0 top
PAD98  248.28,26.81 0 top
PAD99  245.46,23.99 0 top
PAD100  248.28,23.99 0 top
SCL  18.7,239.89 0 top
SCL1  72.67,239.89 0 top
SCL2  126.65,239.89 0 top
SCL3  180.62,239.89 0 top
SCL4  234.6,239.89 0 top
SCL5  18.7,185.91 0 top
SCL6  72.67,185.91 0 top
SCL7  126.65,185.91 0 top
SCL8  180.62,185.91 0 top
SCL9  234.6,185.91 0 top
SCL10  18.7,131.94 0 top
SCL11  72.67,131.94 0 top
SCL12  126.65,131.94 0 top
SCL13  180.62,131.94 0 top
SCL14  234.6,131.94 0 top
SCL15  18.7,77.96 0 top
SCL16  72.67,77.96 0 top
SCL17  126.65,77.96 0 top
SCL18  180.62,77.96 0 top
SCL19  234.6,77.96 0 top
SCL20  18.7,23.99 0 top
SCL21  72.67,23.99 0 top
SCL22  126.65,23.99 0 top
SCL23  180.62,23.99 0 top
SCL24  234.6,23.99 0 top
SDA  18.7,242.71 0 top
SDA1  72.67,242.71 0 top
SDA2  126.65,242.71 0 top
SDA3  180.62,242.71 0 top
SDA4  234.6,242.71 0 top
SDA5  18.7,188.74 0 top
SDA6  72.67,188.74 0 top
SDA7  126.65,188.74 0 top
SDA8  180.62,188.74 0 top
SDA9  234.6,188.74 0 top
SDA10  18.7,134.76 0 top
SDA11  72.67,134.76 0 top
SDA12  126.65,134.76 0 top
SDA13  180.62,134.76 0 top
SDA14  234.6,134.76 0 top
SDA15  18.7,80.79 0 top
SDA16  72.67,80.79 0 top
SDA17  126.65,80.79 0 top
SDA18  180.62,80.79 0 top
SDA19  234.6,80.79 0 top
SDA20  18.7,26.81 0 top
SDA21  72.67,26.81 0 top
SDA22  126.65,26.81 0 top
SDA23  180.62,26.81 0 top
SDA24  234.6,26.81 0 top
VCC  23.99,245.45 0 top
VCC1  77.96,245.45 0 top
VCC2  131.94,245.45 0 top
VCC3  185.91,245.45 0 top
VCC4  239.89,245.45 0 top
VCC5  23.99,191.47 0 top
VCC6  77.96,191.47 0 top
VCC7  131.94,191.47 0 top
VCC8  185.91,191.47 0 top
VCC9  239.89,191.47 0 top
VCC10  23.99,137.5 0 top
VCC11  77.96,137.5 0 top
VCC12  131.94,137.5 0 top
VCC13  185.91,137.5 0 top
VCC14  239.89,137.5 0 top
VCC15  23.99,83.52 0 top
VCC16  77.96,83.52 0 top
VCC17  131.94,83.52 0 top
VCC18  185.91,83.52 0 top
VCC19  239.89,83.52 0 top
VCC20  23.99,29.55 0 top
VCC21  77.96,29.55 0 top
VCC22  131.94,29.55 0 top
VCC23  185.91,29.55 0 top
VCC24  239.89,29.55 0 top

### Tracks (layer width: path | path; a pad name or v marks a point on that pad's centre or on a via)
GND  (via drill 0.55)
  other vias: 10.16,218.44
  pour Top: 0,266.7 266.7,266.7 266.7,0 0,0
  pour Bottom: 0,266.7 266.7,266.7 266.7,0 0,0
GPIO1  (1 unrouted)
GPIO2  (1 unrouted)
GPIO3  (1 unrouted)
GPIO4  (1 unrouted)
GPIO5  (1 unrouted)
GPIO6  (1 unrouted)
GPIO7  (1 unrouted)
GPIO8  (1 unrouted)
GPIO9  (1 unrouted)
GPIO10  (1 unrouted)
GPIO11  (1 unrouted)
GPIO12  (1 unrouted)
GPIO13  (1 unrouted)
GPIO14  (1 unrouted)
GPIO15  (1 unrouted)
GPIO16  (1 unrouted)
GPIO17  (1 unrouted)
GPIO18  (1 unrouted)
GPIO19  (1 unrouted)
GPIO20  (1 unrouted)
GPIO21  (1 unrouted)
GPIO22  (1 unrouted)
GPIO23  (1 unrouted)
GPIO24  (1 unrouted)
N$1  (via drill 0.55)
  other vias: 48.26,218.44
N$2  (via drill 0.55)
  other vias: 48.26,157.48
N$3  (via drill 0.55)
  other vias: 46.99,105.41
N$4  (via drill 0.55)
  other vias: 48.26,52.07
N$5  (via drill 0.55)
  other vias: 102.87,52.07
N$6  (via drill 0.55)
  other vias: 157.48,53.34
N$7  (via drill 0.55)
  other vias: 210.82,54.61
N$8  (via drill 0.55)
  other vias: 204.47,102.87
N$9  (via drill 0.55)
  other vias: 209.55,165.1
N$10  (via drill 0.55)
  other vias: 209.55,218.44
N$11  (via drill 0.55)
  other vias: 153.67,220.98
N$12  (via drill 0.55)
  other vias: 102.87,215.9
N$13  (via drill 0.55)
  other vias: 96.52,106.68
N$14  (via drill 0.55)
  other vias: 160.02,109.22
N$15  (via drill 0.55)
  other vias: 252.73,49.53
N$16  (via drill 0.55)
  other vias: 254,107.95
N$17  (via drill 0.55)
  other vias: 251.46,167.64
N$18  (via drill 0.55)
  other vias: 251.46,215.9
N$19  (via drill 0.55)
  other vias: 209.55,12.7
N$20  (via drill 0.55)
  other vias: 163.83,12.7
N$21  (via drill 0.55)
  other vias: 102.87,12.7
N$22  (via drill 0.55)
  other vias: 43.18,13.97
N$23  (via drill 0.55)
  other vias: 8.89,53.34
N$24  (via drill 0.55)
  other vias: 10.16,110.49
N$25  (via drill 0.55)
  other vias: 12.7,161.29
N$27  (via drill 0.55)
  other vias: 48.26,251.46
N$28  (via drill 0.55)
  other vias: 106.68,256.54
N$29  (via drill 0.55)
  other vias: 161.29,254
N$30  (via drill 0.55)
  other vias: 208.28,254
SCL  (3 unrouted)
  Top 0.254: SCL.1 16.51,242.08 16.51,243.84 20.32,247.65 27.44,247.65 PAD2.1 51.93,242.71 54.75,239.89 71.26,239.89 | 71.26,239.89 69.85,241.3 69.85,243.84 73.66,247.65 81.42,247.65 PAD6.1 86.5,242.57 102.87,242.57 105.55,239.89 SCL2.1 124.6,239.89 123.19,241.3 123.19,243.84 127,247.65 138.43,247.65 140.33,245.75 PAD10.1 140.47,242.57 143.51,242.57 | 71.26,239.89 SCL1.1 | 179.21,239.89 177.8,241.3 177.8,243.84 181.61,247.65 190.5,247.65 194.3,243.85 PAD14.1 194.44,242.57 213.36,242.57 216.04,239.89 SCL4.1 232.55,239.89 231.14,241.3 231.14,243.84 234.95,247.65 243.84,247.65 248.28,243.21 PAD18.1 | 179.21,239.89 SCL3.1 | SCL5.1 16.02,185.91 15.24,186.69 15.24,189.23 20.32,194.31 27.94,194.31 32.38,189.87 PAD22.1 33.16,187.96 52.07,187.96 54.12,185.91 69.36,185.91 | 69.36,185.91 68.58,186.69 68.58,189.23 73.66,194.31 82.55,194.31 86.35,190.51 PAD26.1 104.63,188.74 107.46,185.91 SCL7.1 123.97,185.91 123.19,186.69 123.19,189.23 128.27,194.31 135.89,194.31 | 69.36,185.91 SCL6.1 | 135.89,194.31 140.33,189.87 PAD30.1 141.1,187.96 146.05,187.96 | 177.31,185.91 176.53,186.69 176.53,189.23 181.61,194.31 189.23,194.31 194.3,189.24 PAD34.1 213.85,188.74 216.68,185.91 SCL9.1 231.92,185.91 231.14,186.69 231.14,189.23 236.22,194.31 243.84,194.31 248.28,189.87 PAD38.1 | 177.31,185.91 SCL8.1 | SCL10.1 15.38,131.94 15.24,132.08 15.24,134.62 20.32,139.7 27.94,139.7 32.38,135.26 PAD42.1 51.93,134.76 54.75,131.94 68.72,131.94 | 68.72,131.94 68.58,132.08 68.58,135.89 73.66,140.97 81.28,140.97 86.35,135.9 PAD46.1 107.81,134.76 110.63,131.94 SCL12.1 124.6,131.94 123.19,133.35 123.19,135.89 128.27,140.97 135.89,140.97
  Top 0.254: 68.72,131.94 SCL11.1 | 135.89,140.97 140.33,136.53 PAD50.1 147.32,134.76 | PAD58.1 248.28,136.53 243.84,140.97 236.22,140.97 231.14,135.89 231.14,133.35 232.55,131.94 SCL14.1 216.04,131.94 213.22,134.76 PAD54.1 194.3,135.9 189.23,140.97 181.61,140.97 177.8,137.16 177.8,133.35 179.21,131.94 SCL13.1 162.7,131.94 159.88,134.76 147.32,134.76 | SCL15.1 16.02,77.96 15.24,78.74 15.24,81.28 20.32,86.36 27.94,86.36 32.38,81.92 PAD62.1 48.75,80.79 51.58,77.96 SCL16.1 70.63,77.96 69.85,78.74 69.85,82.55 73.66,86.36 81.28,86.36 86.35,81.29 PAD66.1 104.63,80.79 107.46,77.96 SCL17.1 123.97,77.96 123.19,78.74 123.19,81.28 128.27,86.36 135.89,86.36 | 135.89,86.36 140.33,81.92 PAD70.1 143.51,80.79 | 178.58,77.96 177.8,78.74 177.8,81.28 182.88,86.36 190.5,86.36 194.3,82.56 PAD74.1 213.85,80.79 216.68,77.96 SCL19.1 231.92,77.96 231.14,78.74 231.14,81.28 236.22,86.36 243.84,86.36 248.28,81.92 PAD78.1 | 178.58,77.96 SCL18.1 | SCL20.1 16.65,23.99 15.24,25.4 15.24,27.94 19.05,31.75 27.94,31.75 32.38,27.31 PAD82.1 50.66,26.81 53.48,23.99 71.26,23.99 | 71.26,23.99 69.85,25.4 69.85,27.94 73.66,31.75 82.55,31.75 86.35,27.95 PAD86.1 86.5,26.67 104.14,26.67 106.82,23.99 SCL22.1 124.6,23.99 123.19,25.4 123.19,27.94 127,31.75 135.89,31.75 | 71.26,23.99 SCL21.1 | 135.89,31.75 140.33,27.31 PAD90.1 140.47,26.67 161.29,26.67 163.97,23.99 179.21,23.99 | 179.21,23.99 177.8,25.4 177.8,27.94 181.61,31.75 190.5,31.75 194.3,27.95 PAD94.1 194.44,26.67 213.36,26.67 216.04,23.99 SCL24.1 232.55,23.99 231.14,25.4 231.14,27.94 234.95,31.75 245.11,31.75 248.28,28.58 PAD98.1
  Top 0.254: 179.21,23.99 SCL23.1 | 143.51,242.57 158.75,242.57 161.43,239.89 179.21,239.89 | 146.05,187.96 157.48,187.96 159.53,185.91 177.31,185.91 | 143.51,80.79 159.24,80.79 162.07,77.96 178.58,77.96 | 143.51,80.79 143.51,39.37 135.89,31.75 | 135.89,86.36 135.89,111.76 147.32,123.19 147.32,134.76 | 135.89,140.97 135.89,162.56 146.05,172.72 146.05,187.96 | 135.89,194.31 137.16,195.58 137.16,217.17 143.51,223.52 143.51,242.57
SDA  (3 unrouted)
  Bottom 0.254: PAD4.1 34.29,241.8 34.29,243.84 | 34.29,243.84 34.29,245.11 31.75,247.65 22.86,247.65 18.7,243.49 SDA.1 | PAD8.1 88.9,242.44 88.9,243.84 | 88.9,243.84 88.9,245.11 86.36,247.65 76.2,247.65 72.67,244.12 SDA1.1 72.53,242.57 53.34,242.57 52.07,243.84 34.29,243.84 | 143.51,243.84 143.51,243.07 PAD12.1 140.33,231.77 134.62,226.06 134.62,194.31 | 143.51,243.84 143.51,245.11 140.97,247.65 129.54,247.65 126.65,244.76 SDA2.1 126.51,242.57 105.41,242.57 104.14,243.84 88.9,243.84 | PAD16.1 198.12,243.71 198.12,245.11 | 198.12,245.11 198.12,246.38 196.85,247.65 184.15,247.65 180.62,244.12 SDA3.1 180.48,242.57 160.02,242.57 158.75,243.84 143.51,243.84 | PAD20.1 251.46,243.08 251.46,246.38 250.19,247.65 238.76,247.65 234.6,243.49 SDA4.1 234.46,242.57 215.9,242.57 213.36,245.11 198.12,245.11 | PAD24.1 35.56,189.09 35.56,190.5 | SDA5.1 18.7,190.15 22.86,194.31 34.29,194.31 35.56,193.04 35.56,190.5 | PAD28.1 86.85,185.91 90.17,189.23 90.17,190.5 | 90.17,190.5 90.17,191.77 87.63,194.31 76.2,194.31 72.67,190.78 SDA6.1 53.83,188.74 52.07,190.5 35.56,190.5 | 143.51,190.5 143.51,189.09 PAD32.1 140.33,169.54 134.62,163.83 134.62,140.97 | 143.51,190.5 143.51,191.77 140.97,194.31 134.62,194.31 | 134.62,194.31 130.81,194.31 126.65,190.15 SDA7.1 107.17,188.74 105.41,190.5 90.17,190.5 | PAD36.1 197.87,189.48 | 197.87,189.48 198.12,189.73 198.12,190.5 194.31,194.31 184.15,194.31 180.62,190.78 SDA8.1 159.24,188.74 157.48,190.5 143.51,190.5 | PAD40.1 249.41,185.91 252.73,189.23 252.73,191.77 250.19,194.31 238.76,194.31 234.6,190.15 234.6,189.23 | 234.6,189.23 SDA9.1
  Bottom 0.254: PAD44.1 35.56,135.12 35.56,135.89 | SDA10.1 18.7,135.54 22.86,139.7 33.02,139.7 35.56,137.16 35.56,135.89 | PAD48.1 90.17,135.75 90.17,135.89 | 90.17,135.89 90.17,138.43 87.63,140.97 76.2,140.97 72.67,137.44 SDA11.1 72.53,134.62 55.88,134.62 54.61,135.89 35.56,135.89 | 134.62,140.97 140.97,140.97 143.51,138.43 143.51,135.89 | 134.62,140.97 130.81,140.97 126.65,136.81 SDA12.1 126.51,134.62 109.22,134.62 107.95,135.89 90.17,135.89 | 143.51,135.89 143.51,135.12 PAD52.1 140.33,120.01 134.62,114.3 134.62,86.36 | PAD56.1 198.12,135.75 198.12,135.89 | 198.12,135.89 198.12,138.43 195.58,140.97 184.15,140.97 180.62,137.44 SDA13.1 180.48,134.62 161.29,134.62 160.02,135.89 143.51,135.89 | PAD60.1 252.73,136.39 252.73,138.43 250.19,140.97 237.49,140.97 234.6,138.08 SDA14.1 234.46,134.62 215.9,134.62 214.63,135.89 198.12,135.89 | PAD64.1 35.56,81.14 35.56,81.28 | SDA15.1 18.7,82.2 22.86,86.36 33.02,86.36 35.56,83.82 35.56,81.28 | PAD68.1 90.17,81.78 90.17,82.55 | 72.67,81.28 72.67,82.83 76.2,86.36 88.9,86.36 90.17,85.09 90.17,82.55 | 72.67,81.28 SDA16.1 | 143.51,81.28 143.51,81.14 PAD72.1 140.33,69.21 135.89,64.77 135.89,31.75 | 143.51,81.28 143.51,82.55 139.7,86.36 134.62,86.36 | 134.62,86.36 130.81,86.36 126.65,82.2 126.65,81.28 | 126.65,81.28 SDA17.1 | PAD76.1 198.12,81.78 198.12,82.55 | 180.62,81.28 180.62,81.56 185.42,86.36 195.58,86.36 198.12,83.82 198.12,82.55 | 180.62,81.28 SDA18.1 | PAD80.1 251.46,81.14 251.46,83.82 248.92,86.36 238.76,86.36 234.6,82.2 SDA19.1 218.93,80.79 217.17,82.55 198.12,82.55 | PAD84.1 35.56,27.17 35.56,27.94 | SDA20.1 18.7,28.86 21.59,31.75 33.02,31.75 35.56,29.21 35.56,27.94
  Bottom 0.254: PAD88.1 88.9,26.54 88.9,27.94 | 88.9,27.94 88.9,30.48 87.63,31.75 76.2,31.75 72.67,28.22 SDA21.1 72.53,26.67 53.34,26.67 52.07,27.94 35.56,27.94 | PAD92.1 143.51,27.17 143.51,27.94 | 135.89,31.75 142.24,31.75 143.51,30.48 143.51,27.94 | 135.89,31.75 129.54,31.75 126.65,28.86 SDA22.1 126.51,26.67 106.68,26.67 105.41,27.94 88.9,27.94 | PAD96.1 196.85,26.54 196.85,27.94 | 196.85,27.94 196.85,29.21 194.31,31.75 184.15,31.75 180.62,28.22 SDA23.1 180.48,26.67 162.56,26.67 161.29,27.94 143.51,27.94 | PAD100.1 250.19,25.9 250.19,29.21 247.65,31.75 237.49,31.75 234.6,28.86 SDA24.1 234.46,26.67 215.9,26.67 214.63,27.94 196.85,27.94 | 35.56,81.28 72.67,81.28 | 90.17,82.55 107.95,82.55 109.22,81.28 126.65,81.28 | 143.51,81.28 180.62,81.28 | 197.87,189.48 198.12,189.23 234.6,189.23
VCC  (via drill 0.55)  (1 unrouted)
  Top 0.508: 22.37,242.71 22.86,242.71 25.4,242.71 | 25.4,242.71 PAD1.1 | VCC1.1 77.38,245.45 J2.3 76.34,242.71 78.74,242.71 | 78.74,242.71 PAD5.1 | VCC2.1 131.36,245.45 J3.3 133.63,243.56 134.62,242.57 | 134.62,242.57 137.37,242.57 PAD9.1 | VCC3.1 184.03,243.56 J4.3 186.97,243.56 187.96,242.57 | 187.96,242.57 191.34,242.57 PAD13.1 | VCC4.1 239.31,245.45 J5.3 240.31,243.56 241.3,242.57 | 241.3,242.57 245.32,242.57 PAD17.1 | VCC5.1 23.41,191.47 J6.3 25.05,189.58 25.89,188.74 26.67,188.74 | PAD21.1 26.67,188.74 | VCC6.1 77.38,191.47 J7.3 79.66,189.58 80.5,188.74 | 80.5,188.74 PAD25.1 | VCC7.1 131.36,191.47 J8.3 133,189.58 133.84,188.74 | 133.84,188.74 PAD29.1 | VCC8.1 184.03,189.58 J9.3 187.61,189.58 188.45,188.74 | 188.45,188.74 PAD33.1 | VCC9.1 238,189.58 J10.3 240.95,189.58 241.79,188.74 | 241.79,188.74 PAD37.1 | VCC10.1 23.41,137.5 J11.3 25.68,135.61 26.67,134.62 | 26.67,134.62 29.42,134.62 PAD41.1 | VCC11.1 77.38,137.5 J12.3 75.78,135.89 78.74,135.89 80.01,134.62 | 80.01,134.62 83.39,134.62 PAD45.1 | VCC12.1 131.36,137.5 J13.3 129.75,135.89 133.35,135.89 134.62,134.62 | 134.62,134.62 137.37,134.62 PAD49.1 | VCC13.1 185.33,137.5 J14.3 186.97,135.61 187.96,134.62 | 187.96,134.62 191.34,134.62 PAD53.1 | VCC14.1 239.31,137.5 J15.3 237.7,135.89 241.3,135.89 242.57,134.62 | 242.57,134.62 PAD57.1 | VCC15.1 23.41,83.52 J16.3 25.05,81.63 25.89,80.79 | 25.89,80.79 PAD61.1 | VCC16.1 77.38,83.52 J17.3 78.39,81.63 79.23,80.79 80.01,80.79 | 80.01,80.79 PAD65.1 | VCC17.1 130.05,81.63 J18.3 133,81.63 133.84,80.79 | 133.84,80.79 PAD69.1 | VCC18.1 184.03,81.63 J19.3 187.61,81.63 188.45,80.79 | 188.45,80.79 PAD73.1
  Top 0.508: VCC19.1 238,81.63 J20.3 240.95,81.63 241.79,80.79 | 241.79,80.79 PAD77.1 | VCC20.1 23.41,29.55 J21.3 24.41,27.66 25.4,26.67 26.67,26.67 | 26.67,26.67 29.42,26.67 PAD81.1 | VCC21.1 76.08,27.66 J22.3 79.02,27.66 80.01,26.67 | 80.01,26.67 83.39,26.67 PAD85.1 | VCC22.1 131.36,29.55 J23.3 132.36,27.66 133.35,26.67 | 133.35,26.67 137.37,26.67 PAD89.1 | VCC23.1 185.33,29.55 J24.3 186.97,27.66 187.96,26.67 | 187.96,26.67 191.34,26.67 PAD93.1 | VCC24.1 239.31,29.55 J25.3 240.31,27.66 241.3,26.67 | 241.3,26.67 245.32,26.67 PAD97.1 | 25.4,242.71 25.4,236.22 | 25.4,236.22 7.62,218.44 7.62,177.8 | 26.67,20.32 24.13,17.78 17.78,17.78 7.62,27.94 7.62,72.39 | 26.67,26.67 26.67,20.32 | 7.62,177.8 7.62,127 | 7.62,127 7.62,72.39 | 25.89,80.79 25.89,75.42 | 25.89,75.42 22.86,72.39 7.62,72.39 | 26.67,134.62 26.67,129.54 | 7.62,127 24.13,127 26.67,129.54 | 26.67,188.74 26.67,180.34 | 26.67,180.34 24.13,177.8 7.62,177.8 | 26.67,20.32 29.21,17.78 76.2,17.78 80.01,21.59 | 80.01,26.67 80.01,21.59 | 80.01,21.59 83.82,17.78 132.08,17.78 133.35,19.05 | 133.35,19.05 133.35,26.67 | 133.35,19.05 134.62,17.78 185.42,17.78 187.96,20.32 | 187.96,26.67 187.96,20.32 | 187.96,20.32 190.5,17.78 240.03,17.78 241.3,19.05 241.3,26.67 | 25.89,75.42 28.93,72.39 77.47,72.39 80.01,74.93 | 80.01,74.93 80.01,80.79 | 80.01,74.93 82.55,72.39 130.81,72.39 | 133.84,80.79 133.84,75.42 130.81,72.39 | 130.81,72.39 v139.7,63.5 | v147.32,63.5 156.21,72.39 185.42,72.39 188.45,75.42 | 188.45,80.79 188.45,75.42 | 188.45,75.42 191.49,72.39 237.49,72.39 241.79,76.69 241.79,80.79 | 25.4,236.22 26.67,234.95 76.2,234.95 78.74,237.49 | 78.74,237.49 78.74,242.71
  Top 0.508: 78.74,237.49 81.28,234.95 130.81,234.95 132.72,236.85 | 134.62,242.57 134.62,238.76 132.72,236.85 | v147.32,229.87 152.4,234.95 185.42,234.95 187.96,237.49 | 187.96,242.57 187.96,237.49 | v140.97,228.6 132.72,236.85 | 187.96,237.49 190.5,234.95 238.76,234.95 241.3,237.49 241.3,242.57 | 26.67,180.34 29.21,177.8 49.53,177.8 52.07,180.34 77.47,180.34 80.5,183.37 | 80.5,188.74 80.5,183.37 | 80.5,183.37 83.54,180.34 130.81,180.34 133.84,183.37 | 133.84,183.37 133.84,188.74 | 133.84,183.37 134.13,183.37 137.16,180.34 v143.51,180.34 | v149.86,180.34 185.42,180.34 188.45,183.37 | 188.45,188.74 188.45,183.37 | 188.45,183.37 191.49,180.34 238.76,180.34 241.79,183.37 241.79,188.74 | 26.67,129.54 29.21,127 77.47,127 80.01,129.54 | 80.01,134.62 80.01,129.54 | 80.01,129.54 82.55,127 130.81,127 134.62,130.81 | 134.62,134.62 134.62,130.81 | 134.62,130.81 138.43,127 v143.51,127 | v151.13,127 185.42,127 187.96,129.54 | 187.96,129.54 187.96,134.62 | 187.96,129.54 190.5,127 240.03,127 242.57,129.54 242.57,134.62
  Bottom 0.508: v139.7,63.5 v147.32,63.5 | v140.97,228.6 146.05,228.6 v147.32,229.87 | v143.51,180.34 v149.86,180.34 | v143.51,127 v151.13,127